# Altium schematic sheet History.SchDoc: HISTORY
size A3; Address1: 30 Place d'italie; Address2: 75013 PARIS; Address3: FRANCE; DocumentNumber: 2; SheetNumber: 2; SheetTotal: 3
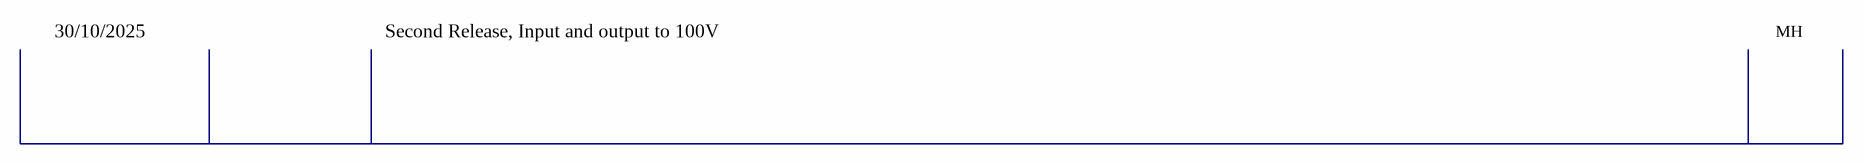
[diagram p0: History.SchDoc]

## Parts
(Parts that share a designator on the sheet are numbered #1, #2 ... from top to bottom, then left to right.)
?#1  (no value)  (graphical)
?#2  (no value)  (graphical)

## Notes on the sheet
- 30/10/2025
- Second Release, Input and output to 100V
- MH
- ASM REF. :
- DATE
- INDEX
- A
- MODIFICATIONS
- BY

## Library data of the parts
?#1 = Title_ech_2: Echosens
?#2 = Title_ech_3: Echosens